# EAGLE design LTC3105Board (EAGLE 6.1)
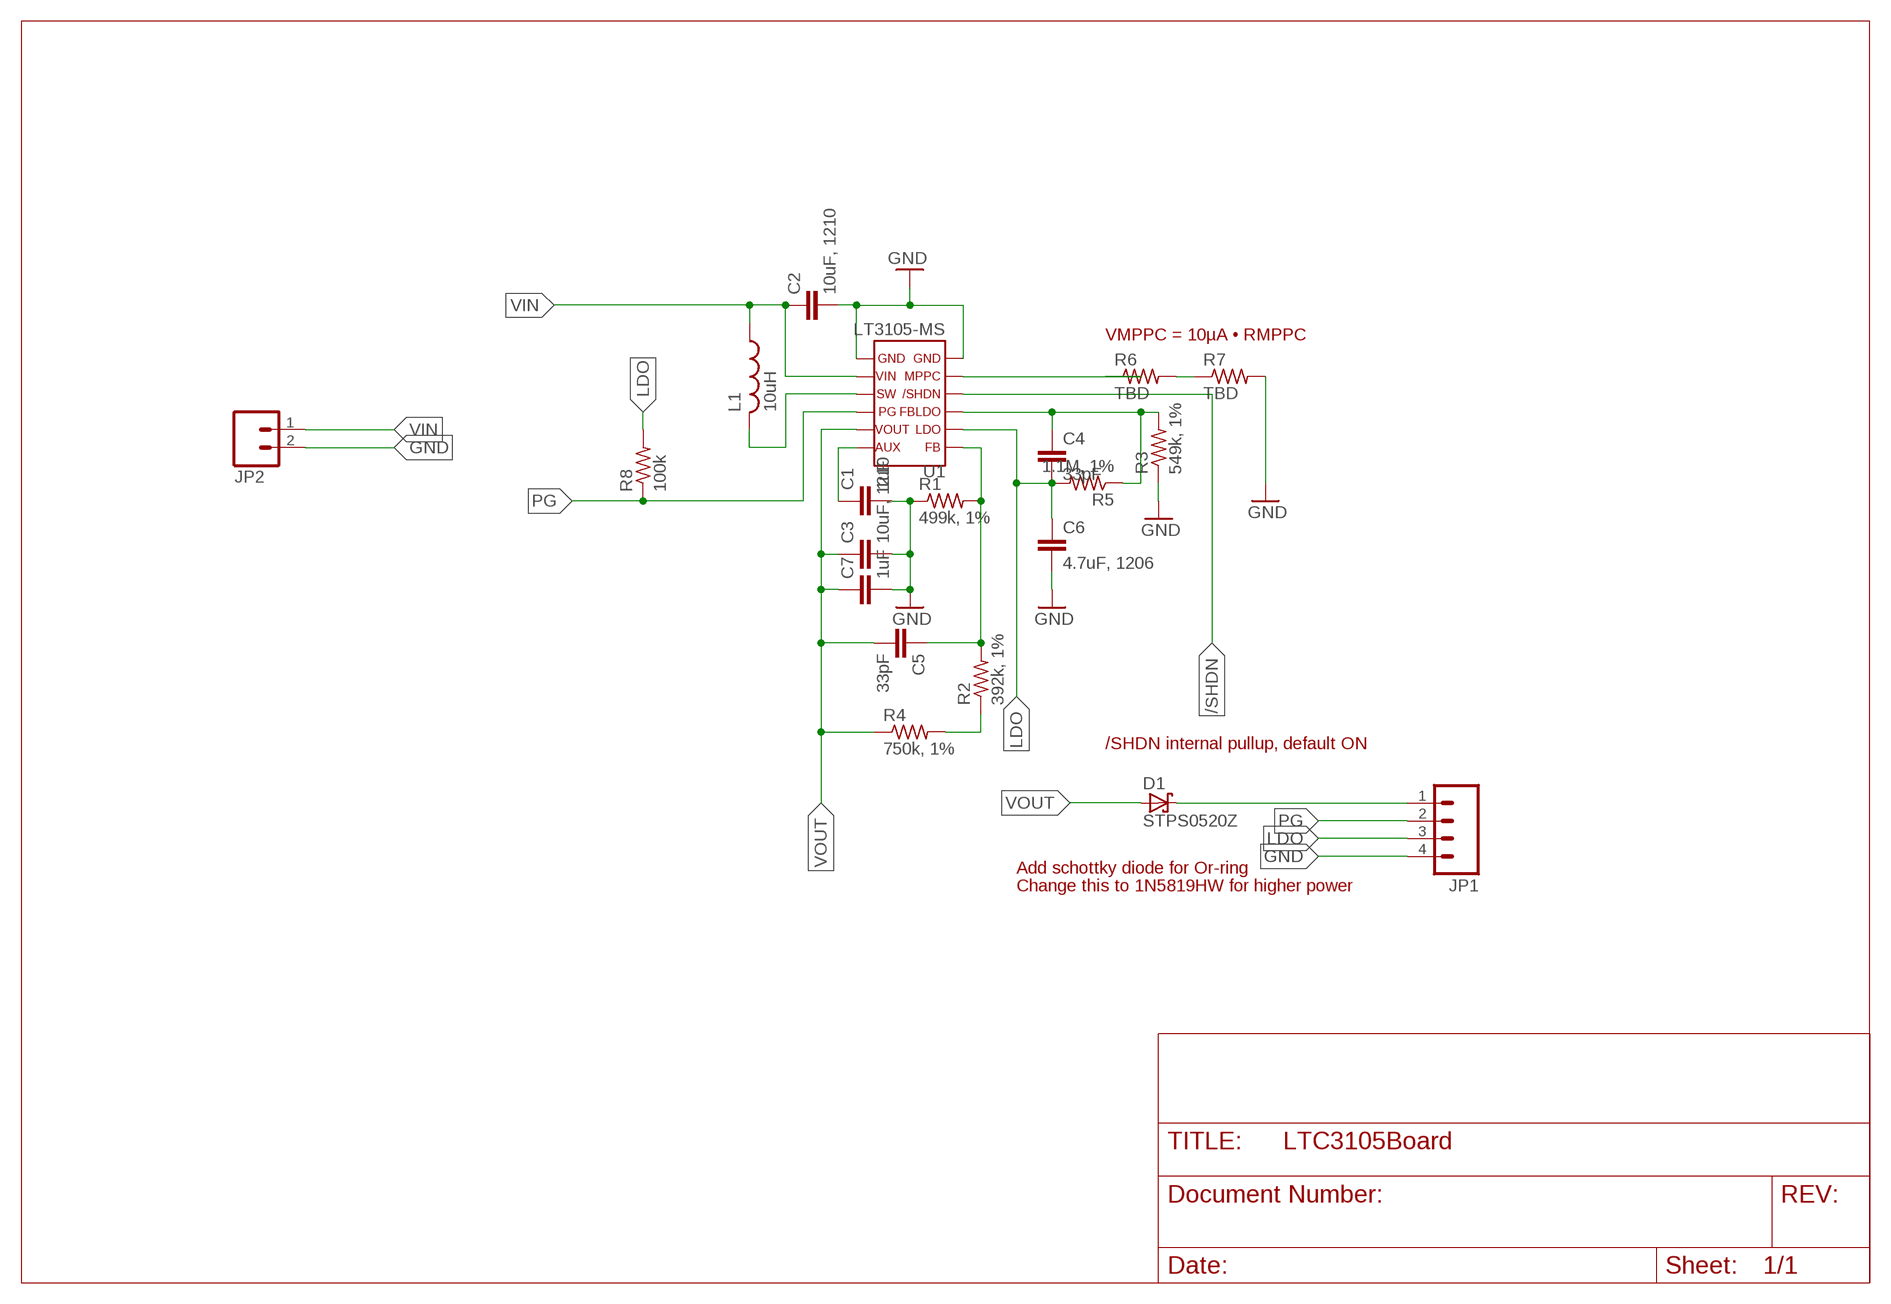
[diagram p0: schematic, sheet 1]

## Parts
C1  1uF  C0603(1608)  [C0603(1608)]
C2  10uF, 1210  C1210(3225)-GCM32  [C1210-GCM32]
C3  10uF, 1210  C1210(3225)-GCM32  [C1210-GCM32]
C4  33pF  C0603(1608)  [C0603(1608)]
C5  33pF  C0603(1608)  [C0603(1608)]
C6  4.7uF, 1206  C1206(3216)-GCM31  [C1206-GCM31]
C7  1uF  C0603(1608)  [C0603(1608)]
D1  STPS0520Z  [SOD-123]
JP1  M04PTH  [1X04]
JP2  M02PTH  [1X02]
L1  10uH  L  [CDRH3D18]
R1  499k, 1%  R0603(1608)  [R0603(1608)]
R2  392k, 1%  R0603(1608)  [R0603(1608)]
R3  549k, 1%  R0603(1608)  [R0603(1608)]
R4  750k, 1%  R0603(1608)  [R0603(1608)]
R5  1.1M, 1%  R0603(1608)  [R0603(1608)]
R6  TBD  R0603(1608)  [R0603(1608)]
R7  TBD  R0603(1608)  [R0603(1608)]
R8  100k  R0603(1608)  [R0603(1608)]
U1  LT3105-MS  [MSOP-12-MS]

## Nets
/SHDN: U1.4
GND: C1.2 C2.P$2 C3.P$2 C6.P$2 C7.2 JP1.4 JP2.2 R1.1 R3.1 R7.2 U1.6 U1.7
LDO: C4.2 C6.P$1 JP1.3 R5.2 R8.2 U1.2
N$1: D1.C JP1.1
N$2: L1.P$2 U1.9
N$3: C1.1 U1.12
N$5: C5.1 R1.2 R2.2 U1.1
N$7: C4.1 R3.2 R5.1 U1.3
N$9: R2.1 R4.2
N$10: R6.1 U1.5
N$11: R6.2 R7.1
PG: JP1.2 R8.1 U1.10
VIN: C2.P$1 JP2.1 L1.P$1 U1.8
VOUT: C3.P$1 C5.2 C7.1 D1.A R4.1 U1.11

## Notes on the sheet
- VMPPC = 10µA • RMPPC
- /SHDN internal pullup, default ON
- Add schottky diode for Or-ring
- Change this to 1N5819HW for higher power

## Library data of the parts
C1-C7 = OSSI:C
D1 = OSSI:STPS0520Z: We use STPS0520Z by st.com diode for solar cell schottky diode. If = 500mA Vrrm = 20V Vf max = 0.32V
JP1 = OSSI:M04: Header 4 Standard 4-pin 0.1" header. Use with straight break away headers (SKU : PRT-00116), right angle break away headers (PRT-00553), swiss pins (PRT-00743), machine pins (PRT-00117), and female headers (PRT-00115). Molex polarized connector foot print use with SKU : PRT-08231 with associated crimp pins and housings. 1MM SMD Version SKU: PRT-10208
JP2 = OSSI:M02: Header 2 Standard 2-pin 0.1" header. Use with straight break away headers (SKU : PRT-00116), right angle break away headers (PRT-00553), swiss pins (PRT-00743), machine pins (PRT-00117), and female headers (PRT-00115). Molex polarized connector foot print use with SKU : PRT-08233 with associated crimp pins and housings.
L1 = OSSI:L
R1-R8 = OSSI:R
U1 = OSSI:LT3105

## Board
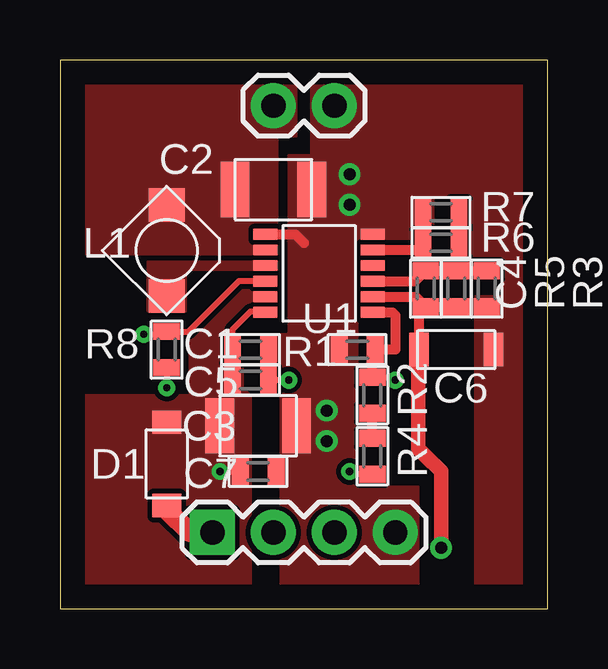
[diagram p1: board, top side]
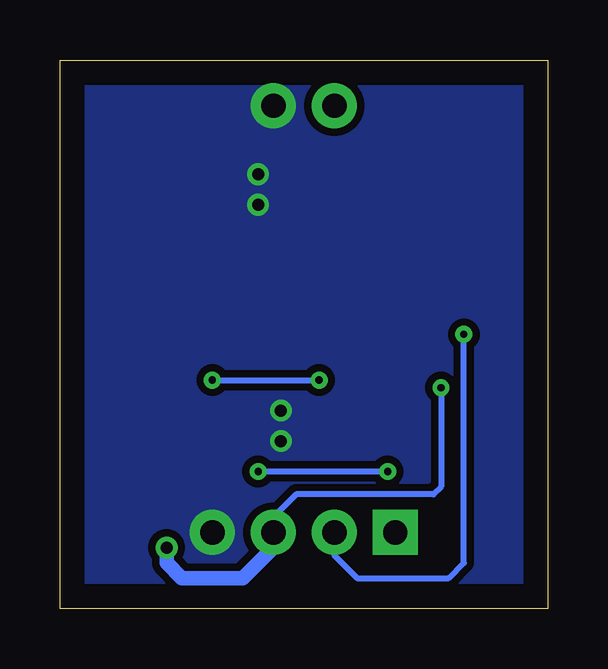
[diagram p2: board, bottom side, seen from below]

Size 20.32 x 22.86 mm. Coordinates in mm from the lower left corner, seen from the top.
Outline: 0,0 20.32,0 20.32,22.86 0,22.86 0,0
Copper layers (1*16): Top 0.035mm / dielectric 1.5mm / Bottom 0.035mm
Design rules: minimum track width 10mil, minimum drill 24mil, track to track 8mil, track to pad 8mil, pad to pad 8mil, via to via 8mil, smd to smd 8mil, copper to edge 40mil, drill to drill 8mil, minimum pad ring 10mil, minimum via ring 8mil, stop-mask expansion 4mil, vias tented up to drill 0mil, thermal gap 10mil

### Footprints (pad centres in the part's own frame; a part is rotated, then mirrored left to right if it is on the bottom)
C0603(1608) = smd 0.7 x 1.1: 1 -0.75,0; 2 0.75,0
C1210-GCM32 = smd 1.2 x 2.3: P$1 -1.6,0; P$2 1.6,0
C1206-GCM31 = smd 0.8 x 1.4: P$1 -1.55,0; P$2 1.55,0
SOD-123 = smd 0.97 x 1.2: A -1.735,0; C 1.735,0
1X04 = drill 1.016 pad 1.88 square: 1 0,0 | drill 1.016 pad 1.88: 2 2.54,0; 3 5.08,0; 4 7.62,0
1X02 = drill 1.016 pad 1.88: 1 0,0; 2 2.54,0
CDRH3D18 = smd 1.4 x 1.5: P$1 -1.9,0; P$2 1.9,0
R0603(1608) = smd 0.7 x 1.1: 1 -0.75,0; 2 0.75,0
MSOP-12-MS = smd 0.45 x 1: 1 -1.625,-2.233; 2 -0.975,-2.233; 3 -0.325,-2.233; 4 0.325,-2.233; 5 0.975,-2.233; 6 1.625,-2.233; 7 1.625,2.233; 8 0.975,2.233; 9 0.325,2.233; 10 -0.325,2.233; 11 -0.975,2.233; 12 -1.625,2.233

### Placement (x,y rotation side)
C1  7.94,10.79 0 top
C2  8.89,17.46 0 top
C3  8.26,7.62 0 top
C4  15.24,13.33 270 top
C5  7.94,9.53 180 top
C6  16.51,10.79 0 top
C7  8.26,5.71 0 top
D1  4.45,6.03 270 top
JP1  6.35,3.17 0 top
JP2  8.89,20.95 0 top
L1  4.45,14.92 270 top
R1  12.38,10.79 0 top
R2  13.02,8.89 90 top
R3  17.78,13.33 90 top
R4  13.02,6.35 90 top
R5  16.51,13.33 270 top
R6  15.88,15.24 0 top
R7  15.88,16.51 180 top
R8  4.45,10.79 270 top
U1  10.79,13.97 90 top

### Tracks (layer width: path | path; a pad name or v marks a point on that pad's centre or on a via)
GND  (via drill 0.5)
  Top 0.406: U1.7 9.8,15.59 10.16,15.24
  other vias: 12.06,16.83 12.06,18.1 11.11,6.98 11.11,8.26
  pour Top (no thermals): 17.3,0 20.32,0 20.32,22.86 10.48,22.86 10.48,18.89 9.53,18.89 9.53,11.43 8.57,11.43 8.57,10.16 9.21,10.16 9.21,0 14.92,0 14.92,5.08 12.38,5.08 12.38,15.24 15.56,15.24 15.56,17.14 17.14,17.14 17.14,14.61 18.41,14.61 18.41,13.02 17.3,13.02
  pour Bottom (isolate 0.305, no thermals): 0,22.86 0,0 20.32,0 20.32,22.86
LDO  (via drill 0.3, 0.5)
  Top 0.254: 14.92,10.48 14.92,10.76 C6.P$1 | R8.2 v4.45,9.21
  Top 0.406: U1.2 14.83,12.99 C4.2 | C4.2 R5.2 | C6.P$1 14.96,12.3 C4.2
  Top 0.61: 14.92,10.48 14.92,9.53 14.92,6.67 15.24,6.35 15.88,5.71 15.88,4.13 15.88,3.49 v15.88,2.54
  Bottom 0.254: v4.45,9.21 4.45,5.08 4.76,4.76 10.48,4.76 11.43,3.81 JP1.3
  Bottom 0.61: v15.88,2.54 15.88,1.91 15.24,1.27 12.7,1.27 11.43,2.54 JP1.3
N$1
  Top 0.813: D1.C 4.45,4.13 5.4,3.17 JP1.1
N$2
  pour Top (no thermals): 9.05,14.45 3.65,14.45 3.65,12.38 5.24,12.38 5.24,14.13 9.05,14.13
N$3
  Top 0.254: C1.1 7.19,11.63 7.94,12.38 8.52,12.38 U1.12
N$5  (via drill 0.3)
  Top 0.254: R2.2 13.86,9.64 v13.97,9.53 | v9.53,9.53 C5.1
  Top 0.406: U1.1 13.85,12.34 13.97,12.22 13.97,10.79 R1.2 13.02,10.68 R2.2
  Bottom 0.254: v13.97,9.53 v9.53,9.53
N$7
  Top 0.406: U1.3 14.8,13.64 C4.1 R5.1 R3.2
N$9
  Top 0.406: R4.2 R2.1
N$10
  Top 0.406: U1.5 15.12,14.95 R6.1
N$11
  Top 0.406: R6.2 16.62,16.39 16.51,16.51 R7.1
PG  (via drill 0.3)
  Top 0.254: U1.10 7.45,13.64 5.56,11.75 5.35,11.54 R8.1 4.33,11.43 v3.49,11.43
  Bottom 0.254: JP1.2 8.89,2.22 7.94,1.27 4.13,1.27 3.49,1.91 v3.49,11.43
VIN
  pour Top (no thermals): 9.05,14.76 0,14.76 0,22.86 9.84,22.86 9.84,19.68 9.05,19.68
VOUT  (via drill 0.3)
  Top 0.254: R4.1 12.27,5.6 v12.06,5.71 | v6.67,5.71 C7.1 | C7.1 7.62,5.71 C7.1
  Bottom 0.254: v12.06,5.71 v6.67,5.71
  pour Top (no thermals): 8.89,12.7 7.94,12.7 7.62,12.38 7.62,9.21 7.94,8.89 7.94,0 0,0 0,8.89 5.4,8.89 5.4,11.43 5.71,11.43 7.62,13.33 8.89,13.33

### Text on the board
Document: VIN | GND | VOUT | PG | LDO | GND